# EAGLE design placa_nano (EAGLE 7.7.0)
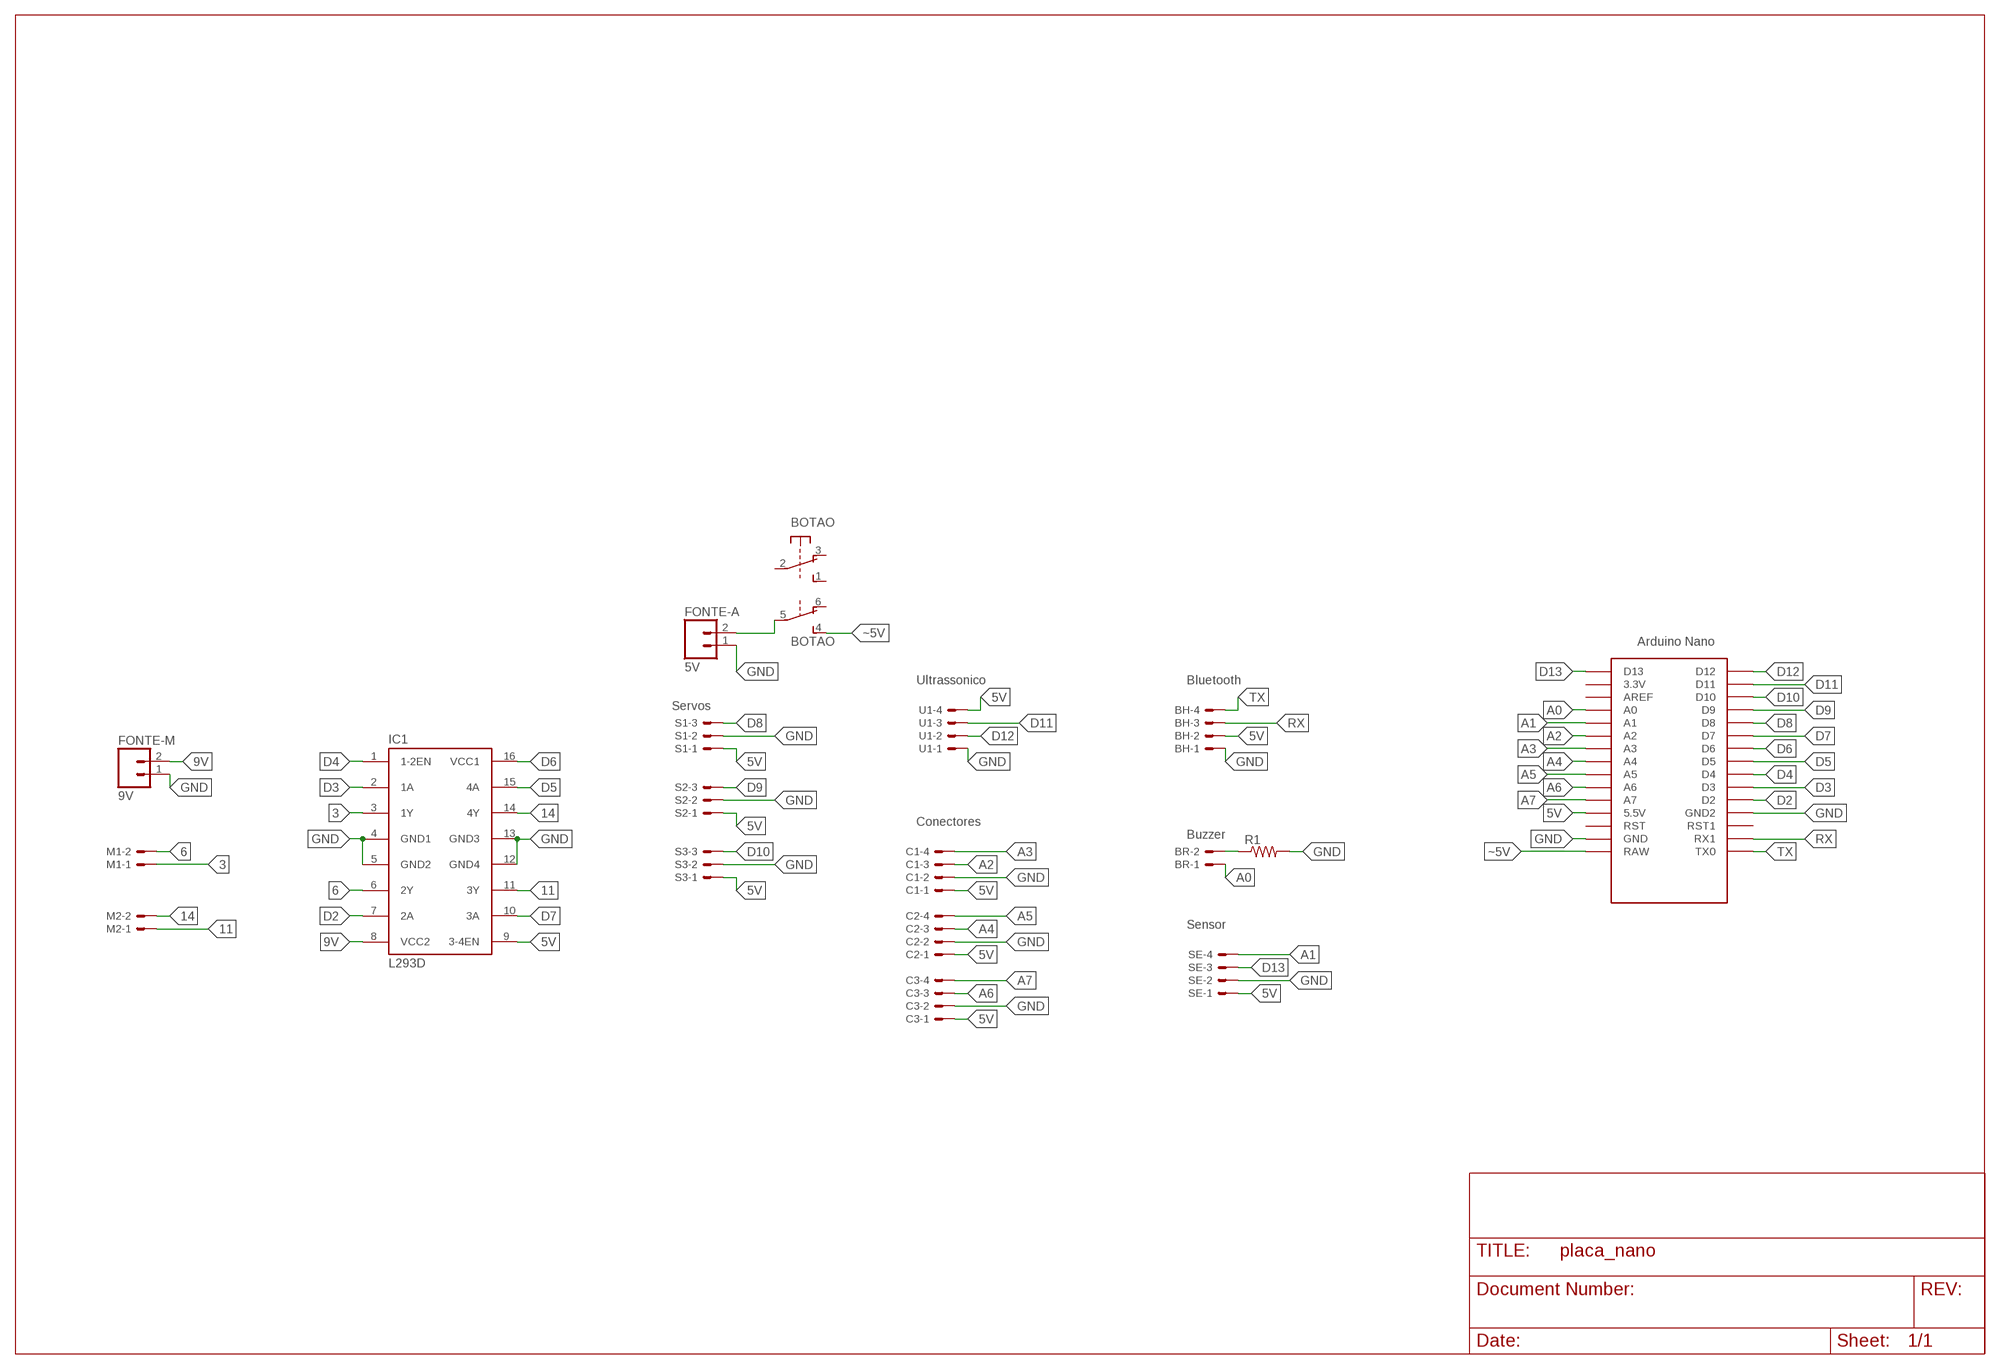
[diagram p0: schematic, sheet 1]

## Parts
BH  22-23-2041  [22-23-2041]
BOTAO  9077-2  [9077-2]
BR  22-23-2021  [22-23-2021]
C1  22-23-2041  [22-23-2041]
C2  22-23-2041  [22-23-2041]
C3  22-23-2041  [22-23-2041]
FONTE-A  5V  M02  [02P]
FONTE-M  9V  M02  [02P]
IC1  L293D  [DIL16]
M1  22-23-2021  [22-23-2021]
M2  22-23-2021  [22-23-2021]
R1  R-US_0207/10  [0207/10]
S1  22-23-2031  [22-23-2031]
S2  22-23-2031  [22-23-2031]
S3  22-23-2031  [22-23-2031]
SE  22-23-2041  [22-23-2041]
U1  22-23-2041  [22-23-2041]
U$1  NANO  [NANO]

## Nets
3: IC1.3(1Y) M1.1
5V: BH.2 C1.1 C2.1 C3.1 IC1.9(3-4EN) S1.1 S2.1 S3.1 SE.1 U1.4 U$1.5V(5.5V)
6: IC1.6(2Y) M1.2
9V: FONTE-M.2 IC1.8(VCC2)
11: IC1.11(3Y) M2.1
14: IC1.14(4Y) M2.2
A0: BR.1 U$1.A0
A1: SE.4 U$1.A1
A2: C1.3 U$1.A2
A3: C1.4 U$1.A3
A4: C2.3 U$1.A4
A5: C2.4 U$1.A5
A6: C3.3 U$1.A6
A7: C3.4 U$1.A7
D2: IC1.7(2A) U$1.D2
D3: IC1.2(1A) U$1.D3
D4: IC1.1(1-2EN) U$1.D4
D5: IC1.15(4A) U$1.D5
D6: IC1.16(VCC1) U$1.D6
D7: IC1.10(3A) U$1.D7
D8: S1.3 U$1.D8
D9: S2.3 U$1.D9
D10: S3.3 U$1.D10
D11: U1.3 U$1.D11
D12: U1.2 U$1.D12
D13: SE.3 U$1.D13
GND: BH.1 C1.2 C2.2 C3.2 FONTE-A.1 FONTE-M.1 IC1.4(GND1) IC1.5(GND2) IC1.12(GND4) IC1.13(GND3) R1.2 S1.2 S2.2 S3.2 SE.2 U1.1 U$1.GND U$1.GND1(GND2)
N$4: BR.2 R1.1
RX: BH.3 U$1.RX1
TX: BH.4 U$1.TX0
~5V: BOTAO.4(2:S) BOTAO.5(2:P) FONTE-A.2 U$1.RAW
Unconnected: BOTAO.1(1:S) BOTAO.2(1:P) BOTAO.3(1:O) BOTAO.6(2:O) U$1.3.3V U$1.AREF U$1.RST U$1.RST1

## Notes on the sheet
- Ultrassonico | Bluetooth
- Servos
- Conectores
- Buzzer
- Sensor

## Library data of the parts
BH C1-C3 SE U1 = con-molex:22-23-2041: .100" (2.54mm) Center Header - 4 Pin; MF: MOLEX; MPN: 22-23-2041; OC_FARNELL: 1462920; OC_NEWARK: 38C0355
BOTAO = switch-misc:9077-2: MARQUARDT SWITCH 9077.0200 Distributor: Buerklin <https://www.buerklin.com/default.asp?event=ShowArtikel%2812G2822%29&l=d&jump=ArtNr_12G2822>
BR M1 M2 = con-molex:22-23-2021: .100" (2.54mm) Center Header - 2 Pin; MF: MOLEX; MPN: 22-23-2021; OC_FARNELL: 1462926; OC_NEWARK: 25C3832
FONTE-A FONTE-M = con-amp-quick:M02: AMP QUICK CONNECTOR; OC_FARNELL: unknown; OC_NEWARK: unknown
IC1 = st-microelectronics:L293D: PUSH-PULL 4 CHANNEL DRIVER; MPN: L293D; OC_FARNELL: 9589619; OC_NEWARK: 56P8249
R1 = resistor:R-US_: RESISTOR, American symbol
S1-S3 = con-molex:22-23-2031: .100" (2.54mm) Center Header - 3 Pin; MF: MOLEX; MPN: 22-23-2031; OC_FARNELL: 1462950; OC_NEWARK: 30C0862
U$1 = Arduino-clone:NANO: Arduino Nano

## Board
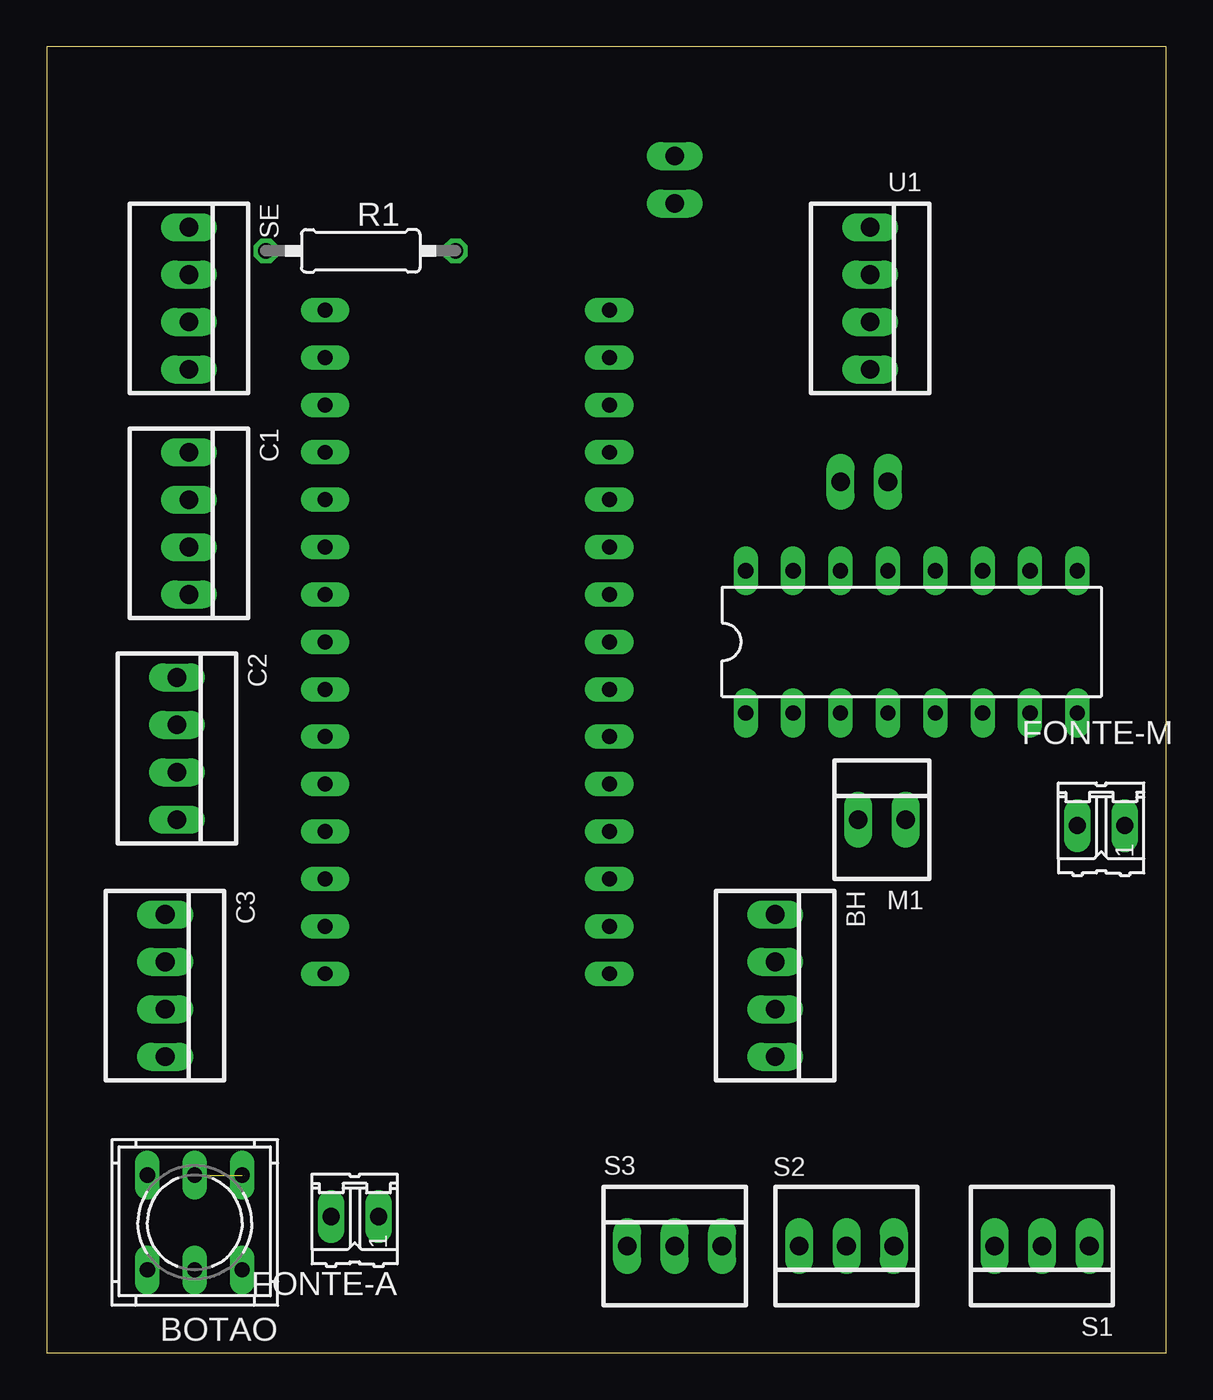
[diagram p1: board, top side]
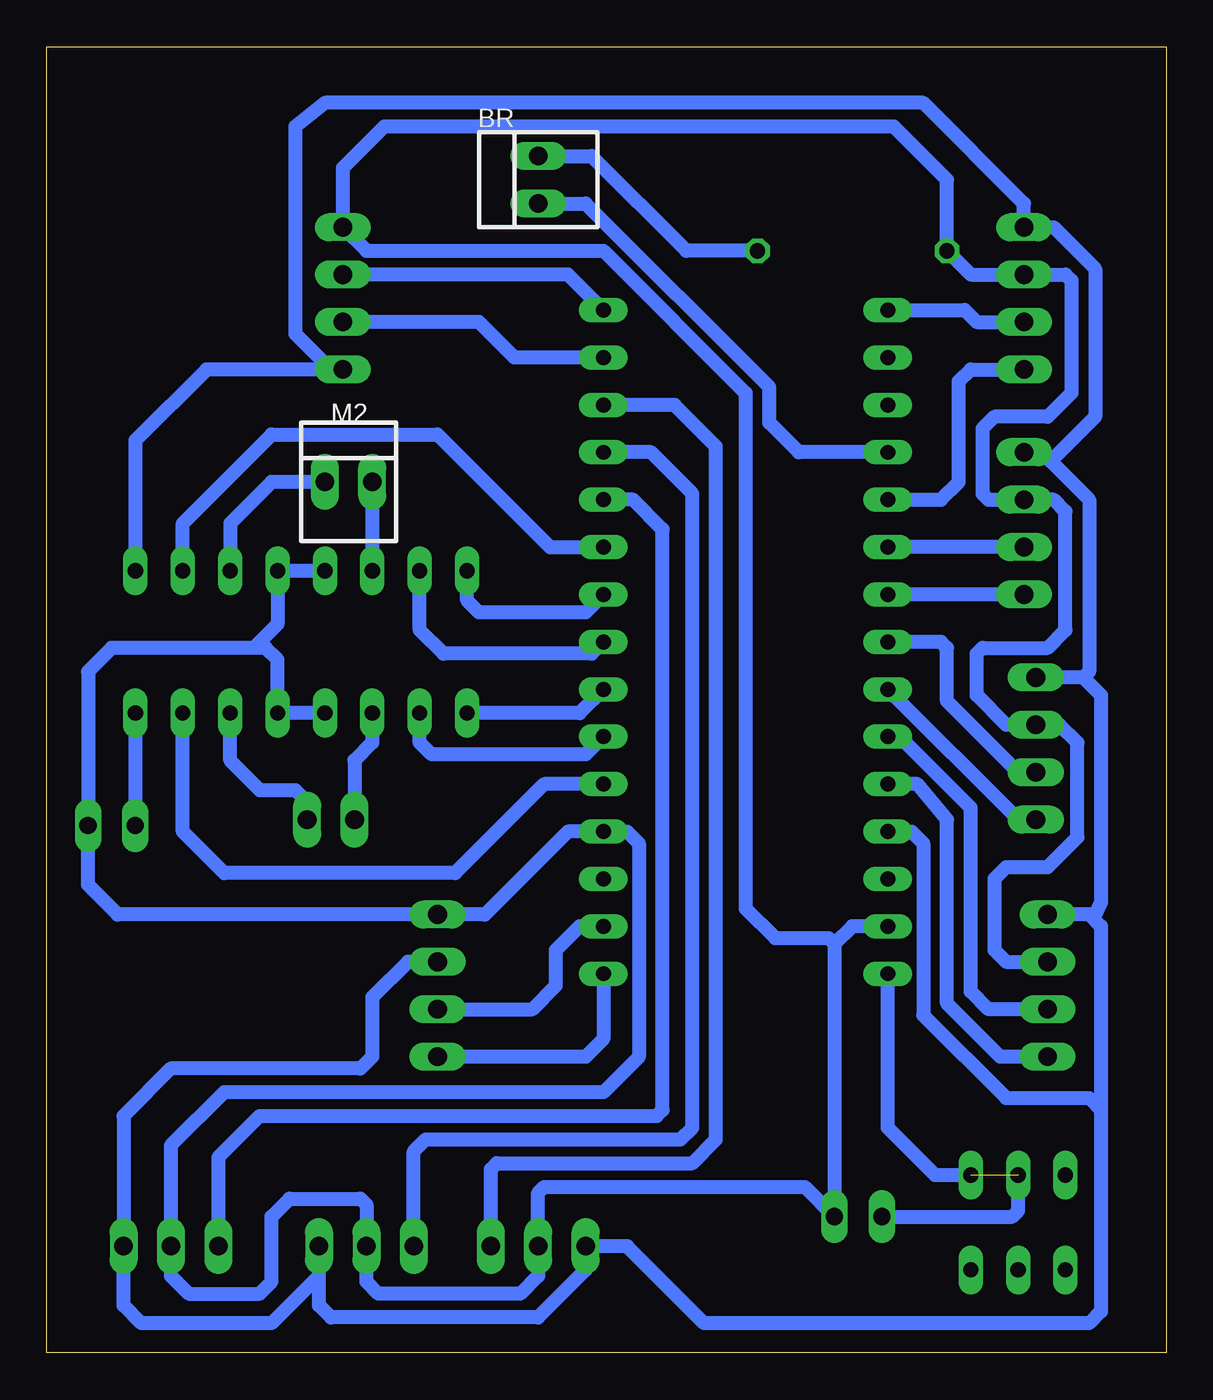
[diagram p2: board, bottom side, seen from below]

Size 60 x 70 mm. Coordinates in mm from the lower left corner, seen from the top.
Outline: 0,0 60,0 60,70 0,70 0,0
Copper layers (1*16): Top 0.035mm / dielectric 1.5mm / Bottom 0.035mm
Design rules "default": minimum track width 10mil, minimum drill 24mil, track to track 8mil, track to pad 8mil, pad to pad 8mil, via to via 8mil, smd to smd 8mil, copper to edge 40mil, drill to drill 8mil, minimum pad ring 10mil, minimum via ring 8mil, stop-mask expansion 4mil, vias tented up to drill 0mil, thermal gap 10mil

### Footprints (pad centres in the part's own frame; a part is rotated, then mirrored left to right if it is on the bottom)
22-23-2041 = drill 1 long: 1 -3.81,0; 2 -1.27,0; 3 1.27,0; 4 3.81,0
9077-2 = drill 0.813 long: 1 -2.54,2.54; 2 0,2.54; 3 2.54,2.54; 4 -2.54,-2.54; 5 0,-2.54; 6 2.54,-2.54
22-23-2021 = drill 1 long: 1 -1.27,0; 2 1.27,0
02P = drill 0.914 long: 1 -1.27,0; 2 1.27,0
DIL16 = drill 0.813 long: 1 -8.89,-3.81; 2 -6.35,-3.81; 3 -3.81,-3.81; 4 -1.27,-3.81; 5 1.27,-3.81; 6 3.81,-3.81; 7 6.35,-3.81; 8 8.89,-3.81; 9 8.89,3.81; 10 6.35,3.81; 11 3.81,3.81; 12 1.27,3.81; 13 -1.27,3.81; 14 -3.81,3.81; 15 -6.35,3.81; 16 -8.89,3.81
0207/10 = drill 0.813 octagon: 1 -5.08,0; 2 5.08,0
22-23-2031 = drill 1 long: 1 -2.54,0; 2 0,0; 3 2.54,0
NANO = drill 0.8 long: 3.3V -10.16,24.13; 5V -10.16,-1.27; A0 -10.16,19.05; A1 -10.16,16.51; A2 -10.16,13.97; A3 -10.16,11.43; A4 -10.16,8.89; A5 -10.16,6.35; A6 -10.16,3.81; A7 -10.16,1.27; AREF -10.16,21.59; D2 5.08,1.27; D3 5.08,3.81; D4 5.08,6.35; D5 5.08,8.89; D6 5.08,11.43; D7 5.08,13.97; D8 5.08,16.51; D9 5.08,19.05; D10 5.08,21.59; D11 5.08,24.13; D12 5.08,26.67; D13 -10.16,26.67; GND -10.16,-6.35; GND1 5.08,-1.27; RAW -10.16,-8.89; RST -10.16,-3.81; RST1 5.08,-3.81; RX1 5.08,-6.35; TX0 5.08,-8.89

### Placement (x,y rotation side)
BH  39.05,19.68 270 top
BOTAO  7.94,6.99 180 top
BR  33.66,62.87 90 bottom
C1  7.62,44.45 270 top
C2  6.99,32.38 270 top
C3  6.35,19.68 270 top
FONTE-A  16.51,7.3 180 top
FONTE-M  56.52,28.26 180 top
IC1  46.35,38.1 0 top
M1  44.77,28.57 0 top
M2  43.81,46.67 0 bottom
R1  16.83,59.05 180 top
S1  53.34,5.71 180 top
S2  42.86,5.71 180 top
S3  33.66,5.71 0 top
SE  7.62,56.52 270 top
U1  44.13,56.52 270 top
U$1  25.08,29.21 0 top

### Tracks (layer width: path | path; a pad name or v marks a point on that pad's centre or on a via)
3
  Bottom 0.762: IC1.3 42.55,32.7 43.5,31.75 M1.1
5V
  Bottom 0.762: IC1.9 55.24,48.9 51.44,52.7 44.77,52.7 | 6.19,47.78 4.13,45.72 4.13,36.51 4.45,36.2 | 6.19,47.78 6.67,48.26 C1.1 | BH.2 40.64,20.95 42.55,19.05 42.55,15.88 43.18,15.24 53.34,15.24 55.88,12.7 S1.1 55.88,2.54 54.93,1.59 47.94,1.59 45.4,4.13 | U1.4 44.77,52.7 | 44.77,52.7 46.67,54.61 46.67,65.72 45.09,66.99 13.02,66.99 7.62,61.59 SE.1 6.03,60.33 3.81,58.1 3.81,50.16 6.19,47.78 | 45.4,4.13 45.4,2.54 44.77,1.91 33.66,1.91 31.11,4.45 S3.1 28.89,5.71 24.77,1.59 4.13,1.59 3.49,2.22 3.49,13.02 | 45.4,4.13 S2.1 | 3.49,13.02 3.49,22.86 4.13,23.5 | 4.13,23.5 3.81,23.5 3.49,24.13 3.49,35.24 4.45,36.2 | 4.13,23.5 C3.1 | 4.45,36.2 C2.1 | U$1.5V 13.65,27.94 13.02,27.3 13.02,18.1 8.57,13.65 4.13,13.65 3.49,13.02
6
  Bottom 0.762: IC1.6 50.16,31.75 48.58,30.16 46.67,30.16 46.04,29.53 M1.2
9V
  Bottom 0.762: IC1.8 FONTE-M.2
11
  Bottom 0.762: M2.1 47.94,46.67 50.16,44.45 IC1.11
14
  Bottom 0.762: M2.2 IC1.14
A0
  Bottom 0.762: U$1.A0 19.68,48.26 21.27,49.85 21.27,51.75 31.11,61.59 BR.1
A1
  Bottom 0.762: U$1.A1 12.06,45.72 11.11,46.67 11.11,52.07 10.48,52.7 SE.4
A2
  Bottom 0.762: C1.3 U$1.A2
A3
  Bottom 0.762: C1.4 U$1.A3
A4
  Bottom 0.762: C2.3 7.94,31.11 11.75,34.92 11.75,37.78 12.06,38.1 U$1.A4
A5
  Bottom 0.762: C2.4 7.94,28.57 U$1.A5
A6
  Bottom 0.762: C3.3 9.53,18.41 10.48,19.37 10.48,29.21 14.29,33.02 U$1.A6
A7
  Bottom 0.762: C3.4 8.89,15.88 11.75,18.73 11.75,28.57 13.34,30.48 U$1.A7
D2
  Bottom 0.762: 52.7,33.97 IC1.7 52.7,27.94 50.48,25.72 38.1,25.72 33.34,30.48 U$1.D2
D3
  Bottom 0.762: U$1.D3 31.11,32.07 39.37,32.07 40.01,32.7 IC1.2
D4
  Bottom 0.762: U$1.D4 31.43,34.29 IC1.1
D5
  Bottom 0.762: U$1.D5 30.8,37.47 38.73,37.47 40.01,38.73 IC1.15
D6
  Bottom 0.762: U$1.D6 31.11,39.69 36.83,39.69 37.47,40.32 IC1.16
D7
  Bottom 0.762: IC1.10 52.7,44.45 47.94,49.21 39.05,49.21 33.02,43.18 U$1.D7
D8
  Bottom 0.762: U$1.D8 28.57,45.72 26.99,44.13 26.99,13.02 27.3,12.7 48.58,12.7 50.8,10.48 S1.3
D9
  Bottom 0.762: S2.3 40.32,10.79 39.69,11.43 26.04,11.43 25.4,12.06 25.4,46.04 27.62,48.26 U$1.D9
D10
  Bottom 0.762: U$1.D10 26.35,50.8 24.13,48.58 24.13,11.43 25.4,10.16 35.88,10.16 36.2,9.84 S3.3
D11
  Bottom 0.762: U$1.D11 34.92,53.34 36.83,55.24 U1.3
D12
  Bottom 0.762: U$1.D12 32.07,57.78 U1.2
D13
  Bottom 0.762: U$1.D13 10.79,55.88 10.16,55.24 SE.3
GND
  Bottom 0.762: IC1.13 IC1.12 47.62,39.05 48.9,37.78 | IC1.4 IC1.5 47.62,37.15 48.26,37.78 48.9,37.78 | 48.9,37.78 56.52,37.78 57.78,36.51 FONTE-M.1 57.78,25.08 56.2,23.5 BH.1 36.51,23.5 32.07,27.94 U$1.GND1 28.89,27.94 28.26,27.3 28.26,15.88 30.16,13.97 50.48,13.97 53.34,11.11 S1.2 53.34,4.13 52.39,3.17 48.58,3.17 47.94,3.81 47.94,7.3 46.99,8.26 43.18,8.26 42.86,7.94 S2.2 42.86,3.81 42.23,3.17 34.61,3.17 33.66,4.13 S3.2 33.66,8.57 33.34,8.89 19.37,8.89 FONTE-A.1 17.78,21.91 | U$1.GND 16.83,22.86 17.78,21.91 | C3.2 8.57,20.95 9.21,21.59 9.21,25.4 8.57,26.04 6.35,26.04 4.76,27.62 4.76,32.7 5.71,33.66 C2.2 8.57,33.66 10.16,35.24 10.16,37.47 9.84,37.78 6.35,37.78 5.4,38.73 5.4,45.09 6.03,45.72 C1.2 9.53,45.72 9.84,46.04 9.84,49.53 9.21,50.16 6.35,50.16 5.08,51.44 5.08,57.47 5.4,57.78 SE.2 10.48,57.78 R1.2 11.75,62.87 14.61,65.72 41.91,65.72 44.13,63.5 U1.1 42.86,59.05 30.16,59.05 22.54,51.44 22.54,23.81 20.95,22.23 18.1,22.23 17.78,21.91
N$4
  Bottom 0.762: R1.1 25.72,59.05 30.8,64.14 BR.2
RX
  Bottom 0.762: BH.3 33.97,18.41 32.7,19.68 32.7,21.59 31.43,22.86 U$1.RX1
TX
  Bottom 0.762: U$1.TX0 30.16,16.83 31.11,15.88 BH.4
~5V  (1 unrouted)
  Bottom 0.762: BOTAO.4 12.38,9.53 14.92,12.06 U$1.RAW | FONTE-A.2 8.26,7.3 7.94,7.62 BOTAO.5